# Altium schematic sheet POWER_2.1.SchDoc
size A3
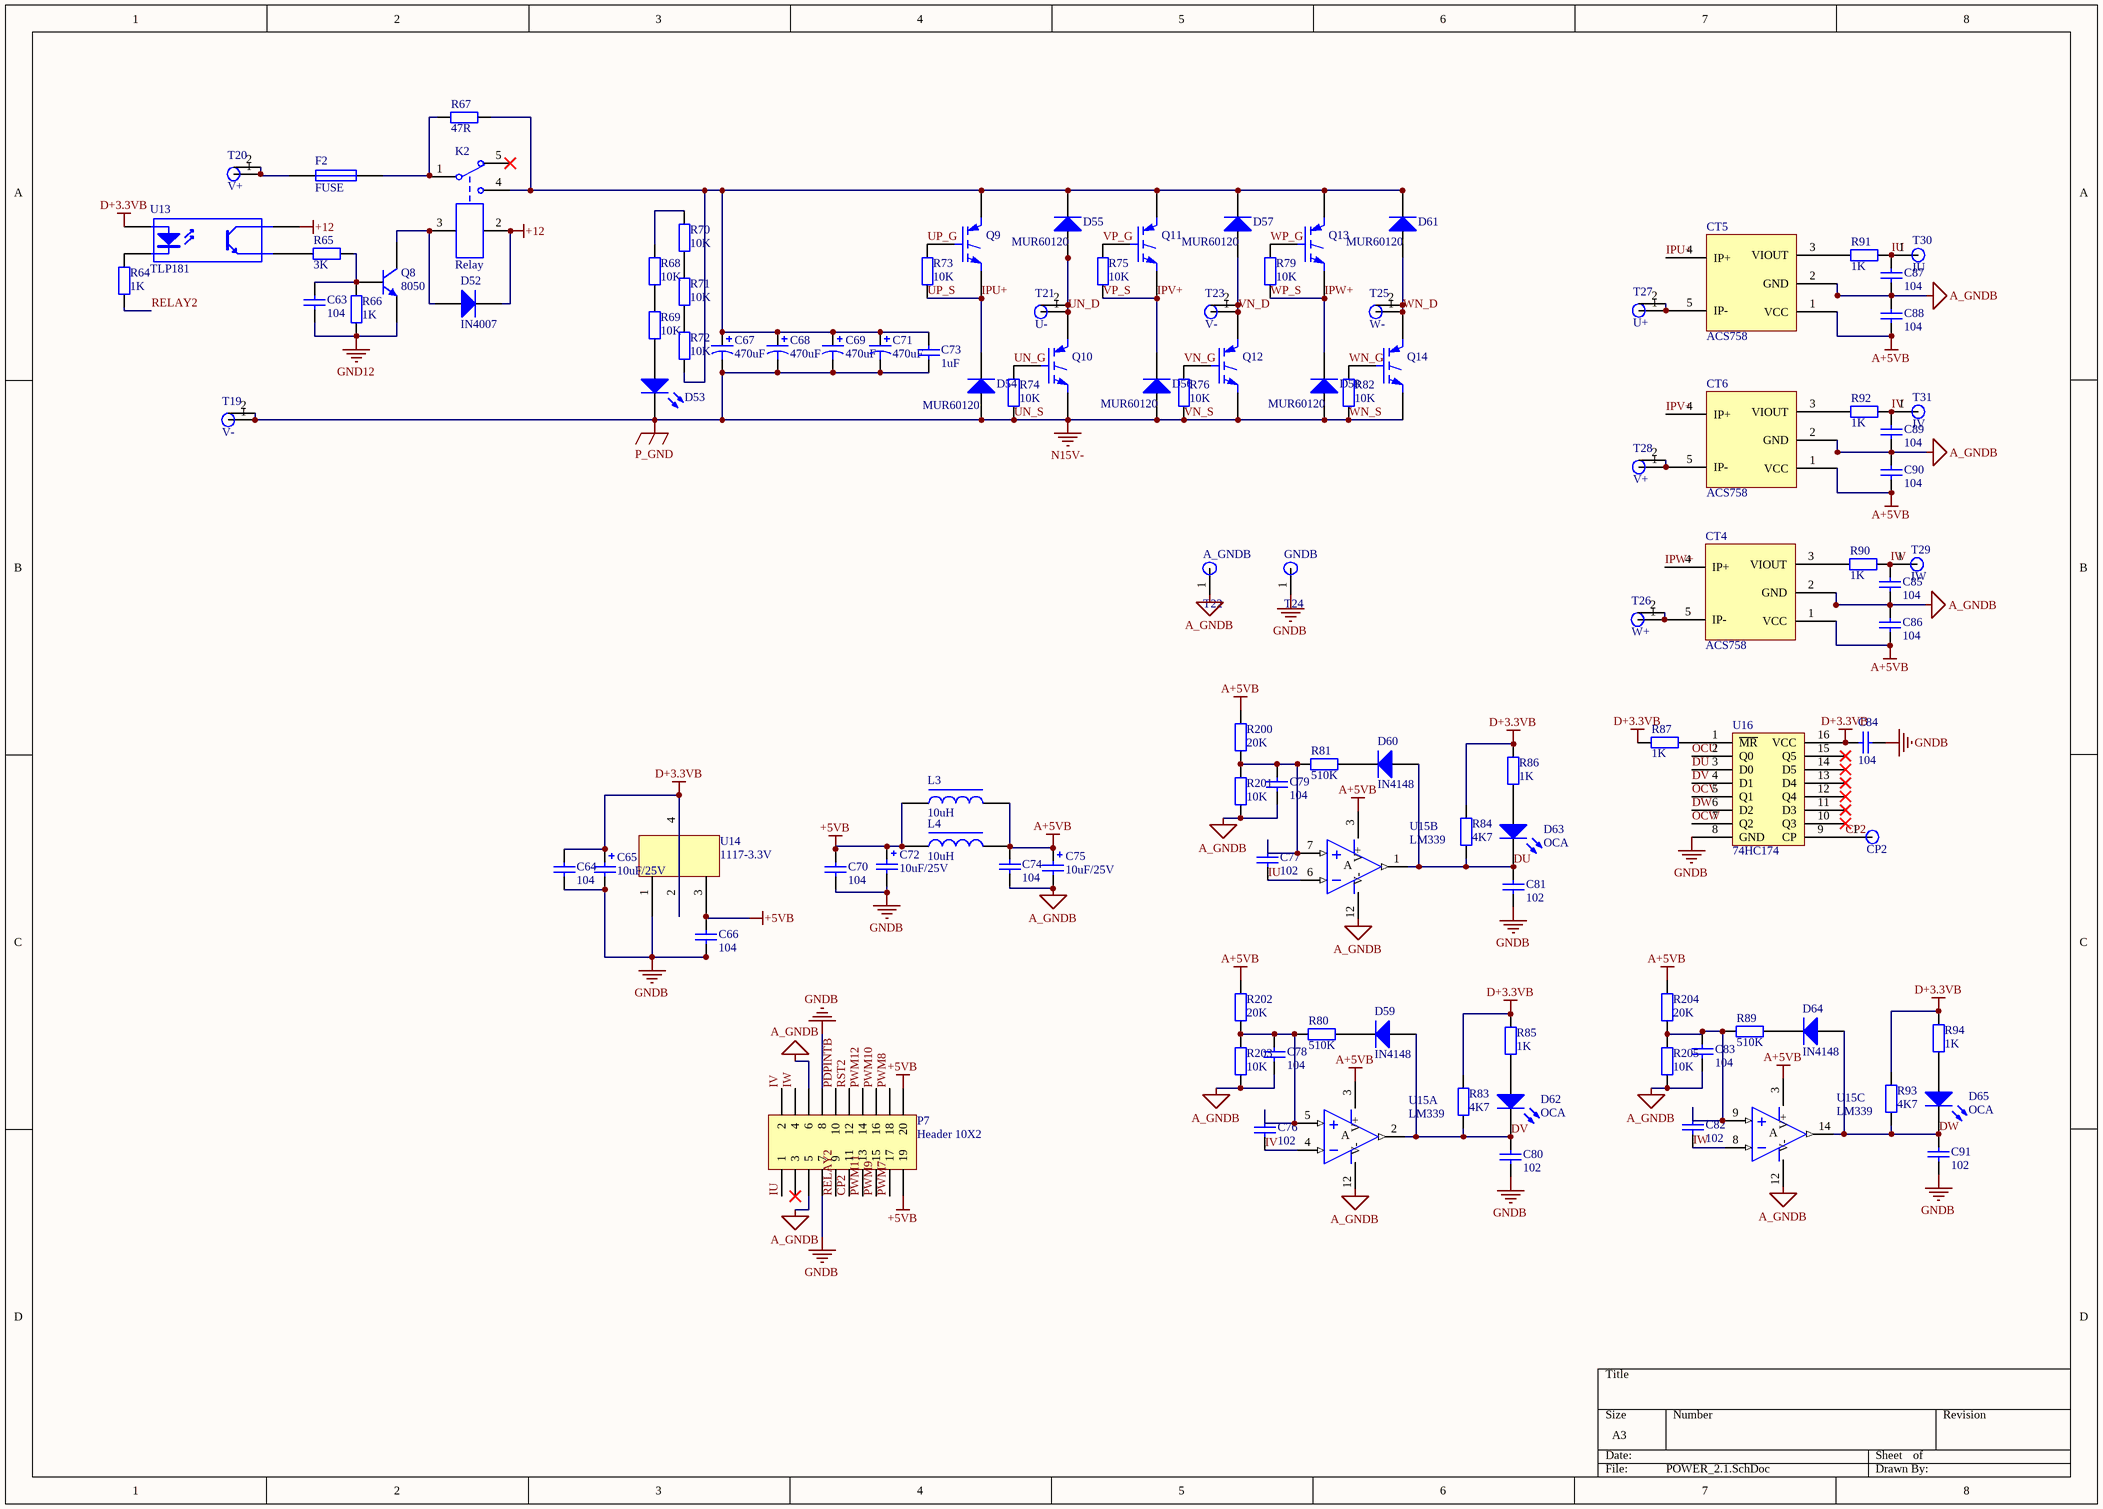
[diagram p0: POWER_2.1.SchDoc]

## Parts
C63  104  [C2012-0805]
C64  104  [C2012-0805]
C65  10uF/25V  [C_10UF/25V]
C66  104  [C2012-0805]
C67  470uF  [Rb400mil-450V]
C68  470uF  [Rb400mil-450V]
C69  470uF  [Rb400mil-450V]
C70  104  [C2012-0805]
C71  470uF  [Rb400mil-450V]
C72  10uF/25V  [C_10UF/25V]
C73  1uF  [Rb800mil]
C74  104  [C2012-0805]
C75  10uF/25V  [C_10UF/25V]
C76  102  [C2012-0805]
C77  102  [C2012-0805]
C78  104  [C2012-0805]
C79  104  [C2012-0805]
C80  102  [C2012-0805]
C81  102  [C2012-0805]
C82  102  [C2012-0805]
C83  104  [C2012-0805]
C84  104  [C2012-0805]
C85  104  [C2012-0805]
C86  104  [C2012-0805]
C87  104  [C2012-0805]
C88  104  [C2012-0805]
C89  104  [C2012-0805]
C90  104  [C2012-0805]
C91  102  [C2012-0805]
CT4  ACS758  [ACS758-LCB-050U-PFF]
CT5  ACS758  [ACS758-LCB-050U-PFF]
CT6  ACS758  [ACS758-LCB-050U-PFF]
D52  IN4007  [DIODE4007]
D53  LED  [LED-SMD]  (value not drawn)
D54  MUR60120  [DIO40A1200V]
D55  MUR60120  [DIO40A1200V]
D56  MUR60120  [DIO40A1200V]
D57  MUR60120  [DIO40A1200V]
D58  MUR60120  [DIO40A1200V]
D59  IN4148  [IN4148]
D60  IN4148  [IN4148]
D61  MUR60120  [DIO40A1200V]
D62  OCA  [LED-SMD]
D63  OCA  [LED-SMD]
D64  IN4148  [IN4148]
D65  OCA  [LED-SMD]
F2  FUSE  [FUSE]
K2  Relay  [Relay(30A)]
L3  10uH  [R2012-0805]
L4  10uH  [R2012-0805]
P7  Header 10X2  [HDR2X10]
Q8  8050  [NPN8050]
Q9  (no value)  [IGBT TO247 40A 1200V]
Q10  (no value)  [IGBT TO247 40A 1200V]
Q11  (no value)  [IGBT TO247 40A 1200V]
Q12  (no value)  [IGBT TO247 40A 1200V]
Q13  (no value)  [IGBT TO247 40A 1200V]
Q14  (no value)  [IGBT TO247 40A 1200V]
R64  1K  [R2012-0805]
R65  3K  [R2012-0805]
R66  1K  [R2012-0805]
R67  47R  [AXIAL-1*1.3]
R68  10K  [R2012-0805]
R69  10K  [R2012-0805]
R70  10K  [R2012-0805]
R71  10K  [R2012-0805]
R72  10K  [R2012-0805]
R73  10K  [R2012-0805]
R74  10K  [R2012-0805]
R75  10K  [R2012-0805]
R76  10K  [R2012-0805]
R79  10K  [R2012-0805]
R80  510K  [R2012-0805]
R81  510K  [R2012-0805]
R82  10K  [R2012-0805]
R83  4K7  [R2012-0805]
R84  4K7  [R2012-0805]
R85  1K  [R2012-0805]
R86  1K  [R2012-0805]
R87  1K  [R2012-0805]
R89  510K  [R2012-0805]
R90  1K  [R2012-0805]
R91  1K  [R2012-0805]
R92  1K  [R2012-0805]
R93  4K7  [R2012-0805]
R94  1K  [R2012-0805]
R200  20K  [R2012-0805]
R201  10K  [R2012-0805]
R202  20K  [R2012-0805]
R203  10K  [R2012-0805]
R204  20K  [R2012-0805]
R205  10K  [R2012-0805]
T19  V-  [TEM]
T20  V+  [TEM]
T21  U-  [TEM]
T22  A_GNDB  [PIN1]
T23  V-  [TEM]
T24  GNDB  [PIN1]
T25  W-  [TEM]
T26  W+  [TEM]
T27  U+  [TEM]
T28  V+  [TEM]
T29  IW  [PIN1]
T30  IU  [PIN1]
T31  IV  [PIN1]
TP5  CP2  [PIN1]
U13  TLP181  [TLP181]
U14  1117-3.3V  [1117-3.3V]
U15  LM339  [LM339]  (parts A,B,C of 4)
U16  74HC174  [74HC174]

## Nets
+5VB: C66.2 C70.2 C72.1 L3.1 L4.1 P7.19 P7.20 U14.3
+12: D52.2(K) K2.2 U13.6(C)
A+5VB: C74.2 C75.1 C86.1 C88.1 C90.1 CT4.1(VCC) CT5.1(VCC) CT6.1(VCC) L3.2 L4.2 R200.1 R202.1 R204.1 U15.3(V+)
A_GNDB: C74.1 C75.2 C78.1 C79.1 C83.1 C85.1 C86.2 C87.1 C88.2 C89.1 C90.2 CT4.2(GND) CT5.2(GND) CT6.2(GND) P7.5 P7.6 R201.2 R203.2 R205.2 T22.1(A) U15.12(V-)
D+3.3VB: C64.2 C65.1 C84.2 R83.2 R84.2 R85.2 R86.2 R87.2 R93.2 R94.2 U13.1(A) U14.2 U14.4 U16.16(VCC)
GND12: C63.1 Q8.2(E) R66.1
GNDB: C64.1 C65.2 C66.1 C70.1 C72.2 C80.1 C81.1 C84.1 C91.1 P7.7 P7.8 T24.1(A) U14.1 U16.8(GND)
UN_S: C67.2 C68.2 C69.2 C71.2 C73.1 D53.2(K) D54.3(A) D56.3(A) D58.3(A) Q10.3(E) Q12.3(E) Q14.3(E) R74.1 R76.1 R82.1 T19.1(A) T19.2  [also labelled N15V-, P_GND, VN_S, WN_S]
CP2: P7.11 TP5.1(A) U16.9(CP)
DU: C81.2 D60.1(A) D63.2(K) R84.1 U15.1(OUT) U16.3(D0)
DV: C80.2 D59.1(A) D62.2(K) R83.1 U15.2(OUT) U16.4(D1)
DW: C91.2 D64.1(A) D65.2(K) R93.1 U15.14(OUT) U16.6(D2)
IPU+: CT5.4(IP+) D54.1(K) Q9.3(E) R73.1  [also labelled UP_S]
IPV+: CT6.4(IP+) D56.1(K) Q11.3(E) R75.1  [also labelled VP_S]
IPW+: CT4.4(IP+) D58.1(K) Q13.3(E) R79.1  [also labelled WP_S]
IU: C77.1 C87.2 P7.1 R91.2 T30.1(A) U15.6(IN+)
IV: C76.1 C89.2 P7.2 R92.2 T31.1(A) U15.4(IN+)
IW: C82.1 C85.2 P7.4 R90.2 T29.1(A) U15.8(IN+)
OCU: U16.2(Q0)
OCV: U16.5(Q1)
OCW: U16.7(Q2)
PDPINTB: P7.10
PWM7: P7.17
PWM8: P7.18
PWM9: P7.15
PWM10: P7.16
PWM11: P7.13
PWM12: P7.14
RELAY2: P7.9 R64.2
RST2: P7.12
UN_D: D55.3(A) Q10.2(C) T21.1(A) T21.2
UN_G: Q10.1(G) R74.2
UP_G: Q9.1(G) R73.2
VN_D: D57.3(A) Q12.2(C) T23.1(A) T23.2
VN_G: Q12.1(G) R76.2
VP_G: Q11.1(G) R75.2
WN_D: D61.3(A) Q14.2(C) T25.1(A) T25.2
WN_G: Q14.1(G) R82.2
WP_G: Q13.1(G) R79.2
NetC63_2: C63.2 Q8.1(B) R65.1 R66.2
NetC67_1: C67.1 C68.1 C69.1 C71.1 C73.2 D55.1(K) D57.1(K) D61.1(K) K2.4 Q9.2(C) Q11.2(C) Q13.2(C) R67.1 R72.1
NetC76_2: C76.2 C78.2 R80.2 R202.2 R203.1 U15.5(IN-)
NetC77_2: C77.2 C79.2 R81.2 R200.2 R201.1 U15.7(IN-)
NetC82_2: C82.2 C83.2 R89.2 R204.2 R205.1 U15.9(IN-)
NetCT4_3: CT4.3(VIOUT) R90.1
NetCT4_5: CT4.5(IP-) T26.1(A) T26.2
NetCT5_3: CT5.3(VIOUT) R91.1
NetCT5_5: CT5.5(IP-) T27.1(A) T27.2
NetCT6_3: CT6.3(VIOUT) R92.1
NetCT6_5: CT6.5(IP-) T28.1(A) T28.2
NetD52_1: D52.1(A) K2.3 Q8.3(C)
NetD53_1: D53.1(A) R69.1
NetD59_2: D59.2(K) R80.1
NetD60_2: D60.2(K) R81.1
NetD62_1: D62.1(A) R85.1
NetD63_1: D63.1(A) R86.1
NetD64_2: D64.2(K) R89.1
NetD65_1: D65.1(A) R94.1
NetF2_1: F2.1 T20.1(A) T20.2
NetF2_2: F2.2 K2.1 R67.2
NetR64_1: R64.1 U13.3(K)
NetR65_2: R65.2 U13.4(E)
NetR68_1: R68.1 R69.2
NetR68_2: R68.2 R70.2
NetR70_1: R70.1 R71.2
NetR71_1: R71.1 R72.2
NetR87_1: R87.1 U16.1(~{MR})

Not connected (* = marked no-connect by the designer): K2 5*; P7 3*; U16 10(Q3)* 11(D3)* 12(Q4)* 13(D4)* 14(D5)* 15(Q5)*

## Notes on the sheet
- (in symbol LM339, part A) A
- (in symbol LM339, part B) A
- (in symbol LM339, part C) A

## Library data of the parts
C63 C64 C66 C70 C74 C76-C91 = Cap: 普通电容
  C63 C64 C66 C70 C74 C78 C79 C83-C90: Value: 104
  C76 C77 C80-C82 C91: Value: 102
C65 C72 C75 = Cap tan: 钽电解; value: 10uF/25V
C67-C69 C71 = Cap pol1: 大电解电容; Value: 470uF
C73 = Cap CBB: CBB电容; Value: 1uF
D52 = Diode IN4007: 普通整流二极管; value: IN4007
D54-D58 D61 = Diode HFA08TB60
D59 D60 D64 = Diode IN4148: 开关二极管
D62 D63 D65 = LED
K2 = Relay(30A)
L3 L4 = Inductor: Value: 10uH
P7 = Header 10X2: Header, 10-Pin, Dual row; LatestRevisionDate: 17-Jul-2002; LatestRevisionNote: Re-released for DXP Platform.; Publisher: Altium Limited
Q8 = NPN8050
Q9-Q14 = IGBT-N
R64-R76 R79-R87 R89-R94 R200-R205 = Res
  R64 R66 R85-R87 R90-R92 R94: Value: 1K
  R65: Value: 3K
  R67: Value: 47R
  R68-R76 R79 R82 R201 R203 R205: Value: 10K
  R80 R81 R89: Value: 510K
  R83 R84 R93: Value: 4K7
  R200 R202 R204: Value: 20K
T19-T21 T23 T25-T28 = TEM: 电源端子
T22 T24 T29-T31 TP5 = TP: 测试脚
U14 = 1117
U16 = 74HC174: 带公共时钟和复位六D触发器